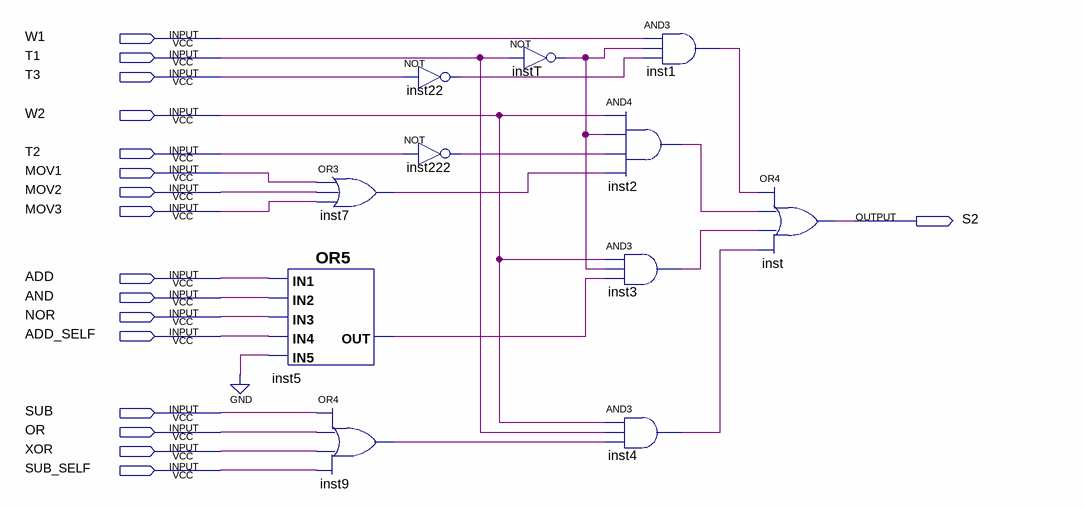
[diagram p0: schematic sheet]
// Quartus schematic S2.bdf as structural Verilog: 11 symbols, 17 pins
module S2 (
  input  W1,
  input  T1,
  input  T3,
  input  W2,
  input  T2,
  input  MOV1,
  input  MOV2,
  input  MOV3,
  input  ADD,
  input  AND,
  input  NOR,
  input  ADD_SELF,
  input  SUB,
  input  OR,
  input  XOR,
  input  SUB_SELF,
  output S2
);

  wire inst1_out, inst2_out, inst3_out, inst4_out, inst5_out, inst7_out, inst9_out, inst22_out, inst222_out,
       instT_out;

  or inst5 (inst5_out, ADD, AND, NOR, ADD_SELF, 1'b0);
  or inst7 (inst7_out, MOV1, MOV2, MOV3);
  or inst9 (inst9_out, SUB, OR, XOR, SUB_SELF);
  not inst22 (inst22_out, T3);
  not inst222 (inst222_out, T2);
  not instT (instT_out, T1);
  and inst1 (inst1_out, W1, instT_out, inst22_out);
  and inst2 (inst2_out, W2, instT_out, inst222_out, inst7_out);
  and inst3 (inst3_out, W2, instT_out, inst5_out);
  and inst4 (inst4_out, W2, T1, inst9_out);
  or inst (S2, inst1_out, inst2_out, inst3_out, inst4_out);
endmodule
